# Altium project MainBoard.PrjPCB (part 2 of 2)

## Sheet Mainboard_Breakbeam_Interface.SchDoc
size A4
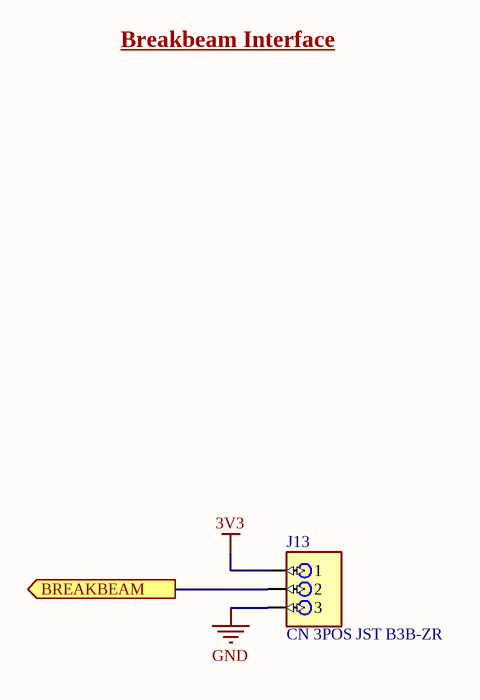
[diagram p6: Mainboard_Breakbeam_Interface.SchDoc]

### Parts
J13  CN 3POS JST B3B-ZR  [CN 3POS JST B3B-ZR]

### Ports
BREAKBEAM (out)

### Nets
3V3: J13.1
GND: J13.3
NetJ13_2: J13.2 ; port BREAKBEAM

### Notes on the sheet
- Breakbeam Interface

### Library data of the parts
J13 = CN 3POS JST B3B-ZR: Connector Header Through Hole 3 position 0.059 (1.50mm); MF: JST Sales; Price: $0.18; MP: B3B-ZR; Package: Bulk; Check_prices: https://www.snapeda.com/parts/B3B-ZR/JST%20Sales%20America%20Inc./view-part/496625/?ref=eda; SnapEDA_Link: https://www.snapeda.com/parts/B3B-ZR/JST%20Sales%20America%20Inc./view-part/496625/?ref=snap; Value: *; Availability: Active; ComponentLink1Description: Digikey Link; ComponentLink1URL: https://www.digikey.com/en/products/detail/jst-sales-america-inc/B3B-ZR(LF)(SN)/926565?utm_source=snapeda&utm_medium=aggregator&utm_campaign=buynow

## Sheet MainBoard_MCU_Power.SchDoc
size B
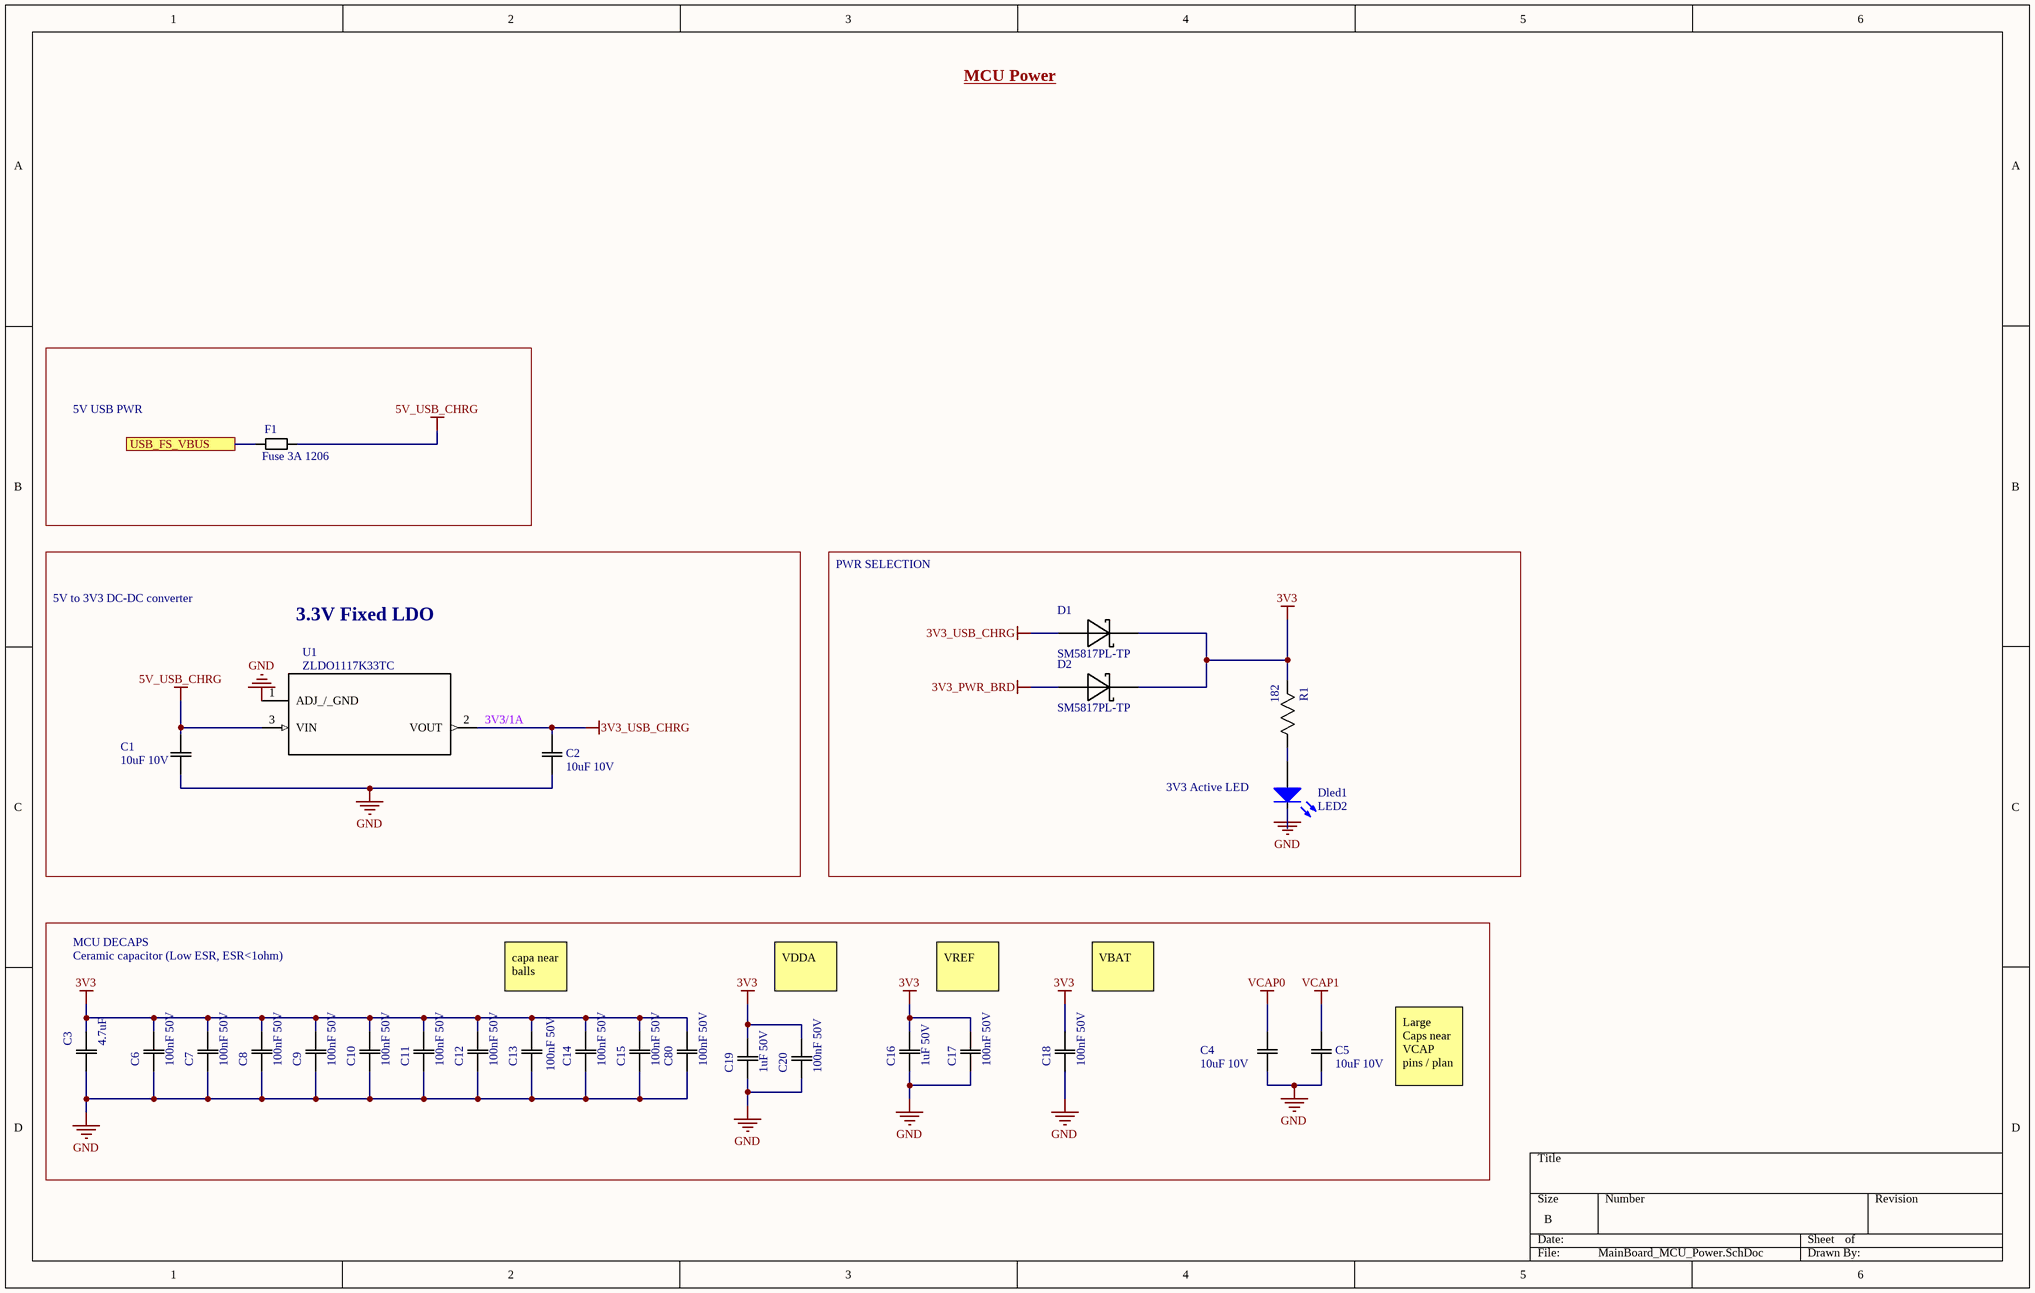
[diagram p7: MainBoard_MCU_Power.SchDoc]

### Parts
C1  10uF 10V  [0805]
C2  10uF 10V  [0805]
C3  4.7uF  [0805]
C4  10uF 10V  [0805]
C5  10uF 10V  [0805]
C6  100nF 50V  [0805]
C7  100nF 50V  [0805]
C8  100nF 50V  [0805]
C9  100nF 50V  [0805]
C10  100nF 50V  [0805]
C11  100nF 50V  [0805]
C12  100nF 50V  [0805]
C13  100nF 50V  [0805]
C14  100nF 50V  [0805]
C15  100nF 50V  [0805]
C16  1uF 50V  [0805]
C17  100nF 50V  [0805]
C18  100nF 50V  [0805]
C19  1uF 50V  [0805]
C20  100nF 50V  [0805]
C80  100nF 50V  [0805]
D1  SM5817PL-TP  [SOD-123]
D2  SM5817PL-TP  [SOD-123]
Dled1  LED2  [3.2X1.6X1.1]
F1  Fuse 3A 1206  [1206]
R1  182  [0805]
U1  ZLDO1117K33TC  [DPAK (TO-252)]

### Blocks framed on the sheet
5V USB PWR: F1
3.3V Fixed LDO: C1 C2 U1

### Ports
USB_FS_VBUS

### Nets
3V3: C3.2(C2) C6.2(C2) C7.2(C2) C8.2(C2) C9.2(C2) C10.2(C2) C11.2(C2) C12.2(C2) C13.2(C2) C14.2(C2) C15.2(C2) C16.2(C2) C17.2(C2) C18.2(C2) C19.2(C2) C20.2(C2) C80.2(C2) D1.C(K) D2.C(K) R1.2(R2)
3V3_PWR_BRD: D2.A
3V3_USB_CHRG: C2.1(C1) D1.A U1.2(VOUT)
5V_USB_CHRG: C1.1(C1) F1.2 U1.3(VIN)
GND: C1.2(C2) C2.2(C2) C3.1(C1) C4.2(C2) C5.2(C2) C6.1(C1) C7.1(C1) C8.1(C1) C9.1(C1) C10.1(C1) C11.1(C1) C12.1(C1) C13.1(C1) C14.1(C1) C15.1(C1) C16.1(C1) C17.1(C1) C18.1(C1) C19.1(C1) C20.1(C1) C80.1(C1) Dled1.2(K) U1.1(ADJ_/_GND)
VCAP0: C4.1(C1)
VCAP1: C5.1(C1)
NetDled1_1: Dled1.1(A) R1.1(R1)
NetF1_1: F1.1 ; port USB_FS_VBUS

### Notes on the sheet
- MCU Power
- PWR SELECTION
- 5V to 3V3 DC-DC converter
- 3V3/1A
- (near Dled1) 3V3 Active LED
- MCU DECAPS
- Ceramic capacitor (Low ESR, ESR<1ohm)
- capa near balls
- VDDA
- VREF
- VBAT
- Large Caps near VCAP pins / plan

### Library data of the parts
C1 C2 C4 C5 = CAP 10uF 10V: CAP CER 10UF 10V X5R 0805; Tolerance: 10%; Package: 0805; Value: 10uF; Rating: 10V
C3 = CAP 4.7uF 35V: CAP CER 4.7UF 35V X7R 0603/0805; Tolerance: 10%; Package: 0603/0805; Value: 4.7uF; Rating: 35V; Temperature Coefficient: X7R; Operating Temperature: -55°C ~ 125°C
C6-C15 C17 C18 C20 C80 = CAP 100nF 50V: as C27 on sheet Mainboard_Encoder_Interface; Package: 0805; Value: 100nF; Rating: 50V
C16 C19 = CAP 1uF 50V: CAP CER 1UF 50V X7R 0805; Tolerance: 10%; Package: 0805; Value: 1uF; Rating: 50V; Temperature Coefficient: X7R; Operating Temperature: -55°C ~ 125°C
D1 D2 = DIODE SCHOTTKY 20V 1A: Diode Schottky 20V 1A Surface Mount SOD-123FL; MF: Micro Commercial Co; ComponentLink1Description: digikey; ComponentLink1URL: https://www.digikey.ca/product-detail/en/on-semiconductor/MBR0540T1G/MBR0540T1GOSCT-ND/917967; Digikey: SM5817PL-TPMSCT-ND; Digikey Link: https://www.digikey.ca/product-detail/en/micro-commercial-co/SM5817PL-TP/SM5817PL-TPMSCT-ND/1793410; MP: SM5817PL-TP; Voltage Rating: 20V; Package: SOD-123; Current Rating: 1A
Dled1 = LED GREEN SMD: Typical RED, GREEN, YELLOW, AMBER GaAs LED; Voltage - Forward (Vf) (Typ): 2V; Lens Transparency: Clear; Current - Test: 20mA; Package: 1206; Color: Green
F1 = FUSE 3A 63V SLOW: FUSE 3A 63V AC/DC SLOW 1206; Response Time: Slow Blow; Current Rating (Amps): 3A; Operating Temperature: -55°C ~ 90°C; Voltage Rating - AC: 63V; Voltage Rating - DC: 63V
R1 = RES 182.0 1/8W: RES SMD 182 OHM 1% 1/8W 0805; Power (Watts): 0.125W; Package: 0805; Value: 182; Tolerance: 1%
U1 = ZLDO1117K33TC: Linear Voltage Regulator IC Positive Fixed 1 Output  1A TO-252-3; MF: Diodes Incorporated; Package: TO-252-3; MP: ZLDO1117K33TC; Digikey: ZLDO1117K33DIDKR-ND; Digikey Link: https://www.digikey.ca/product-detail/en/diodes-incorporated/ZLDO1117K33TC/ZLDO1117K33DIDKR-ND/2095639; Supplier 1: Digi-Key; Supplier Part Number 1: ZLDO1117K33DICT-ND

## Sheet Mainboard_Debug_Interface.SchDoc
size A4
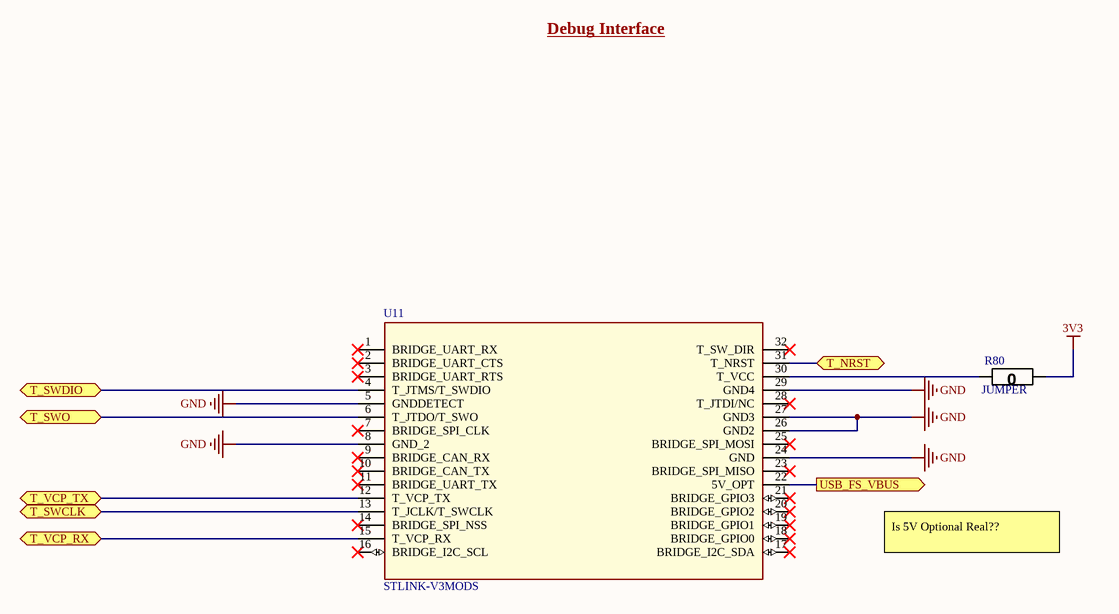
[diagram p8: Mainboard_Debug_Interface.SchDoc]

### Parts
R80  JUMPER  [0805]
U11  STLINK-V3MODS  [STLINK-V3MODS]

### Ports
T_NRST (bidir), T_SWCLK (bidir), T_SWDIO (bidir), T_SWO (bidir), T_VCP_RX (bidir), T_VCP_TX (bidir), USB_FS_VBUS (out)

### Nets
3V3: R80.1(R1)
GND: U11.5(GNDDETECT) U11.8(GND_2) U11.24(GND) U11.26(GND2) U11.27(GND3) U11.29(GND4)
NetC70_2: U11.31(T_NRST) ; port T_NRST
NetF1_1: U11.22(5V_OPT) ; port USB_FS_VBUS
NetR80_2: R80.2(R2) U11.30(T_VCC)
NetU11_4: U11.4(T_JTMS/T_SWDIO) ; port T_SWDIO
NetU11_6: U11.6(T_JTDO/T_SWO) ; port T_SWO
NetU11_12: U11.12(T_VCP_TX) ; port T_VCP_TX
NetU11_13: U11.13(T_JCLK/T_SWCLK) ; port T_SWCLK
NetU11_15: U11.15(T_VCP_RX) ; port T_VCP_RX

Not connected (* = marked no-connect by the designer): U11 1(BRIDGE_UART_RX)* 2(BRIDGE_UART_CTS)* 3(BRIDGE_UART_RTS)* 7(BRIDGE_SPI_CLK)* 9(BRIDGE_CAN_RX)* 10(BRIDGE_CAN_TX)* 11(BRIDGE_UART_TX)* 14(BRIDGE_SPI_NSS)* 16(BRIDGE_I2C_SCL)* 17(BRIDGE_I2C_SDA)* 18(BRIDGE_GPIO0)* 19(BRIDGE_GPIO1)* 20(BRIDGE_GPIO2)* 21(BRIDGE_GPIO3)* 23(BRIDGE_SPI_MISO)* 25(BRIDGE_SPI_MOSI)* 28(T_JTDI/NC)* 32(T_SW_DIR)*

### Notes on the sheet
- Debug Interface
- Is 5V Optional Real??

### Library data of the parts
R80 = RES 0 JUMPER: RES SMD 0 OHM JUMPER GENERIC 0805; Value: 0; Package: 0805
U11 = STLINK-V3MODS: STM32 - Debugger, Programmer (In-Circuit/In-System); MF: STMicroelectronics; MP: STLINK-V3MODS; Price: $12.15; ComponentLink1Description: Digikey; ComponentLink1URL: https://www.digikey.ca/en/products/detail/stmicroelectronics/stlink-v3mods/11610874; ComponentLink2Description: SnapEDA; ComponentLink2URL: https://www.snapeda.com/parts/STLINK-V3MODS/STMicroelectronics/view-part/; ComponentLink3Description: Datasheet; ComponentLink3URL: https://www.st.com/resource/en/data_brief/stlink-v3mods.pdf; Digikey PN: 497-STLINK-V3MODS-ND

## Sheet Mainboard_MCU_Breakout.SchDoc
size A4
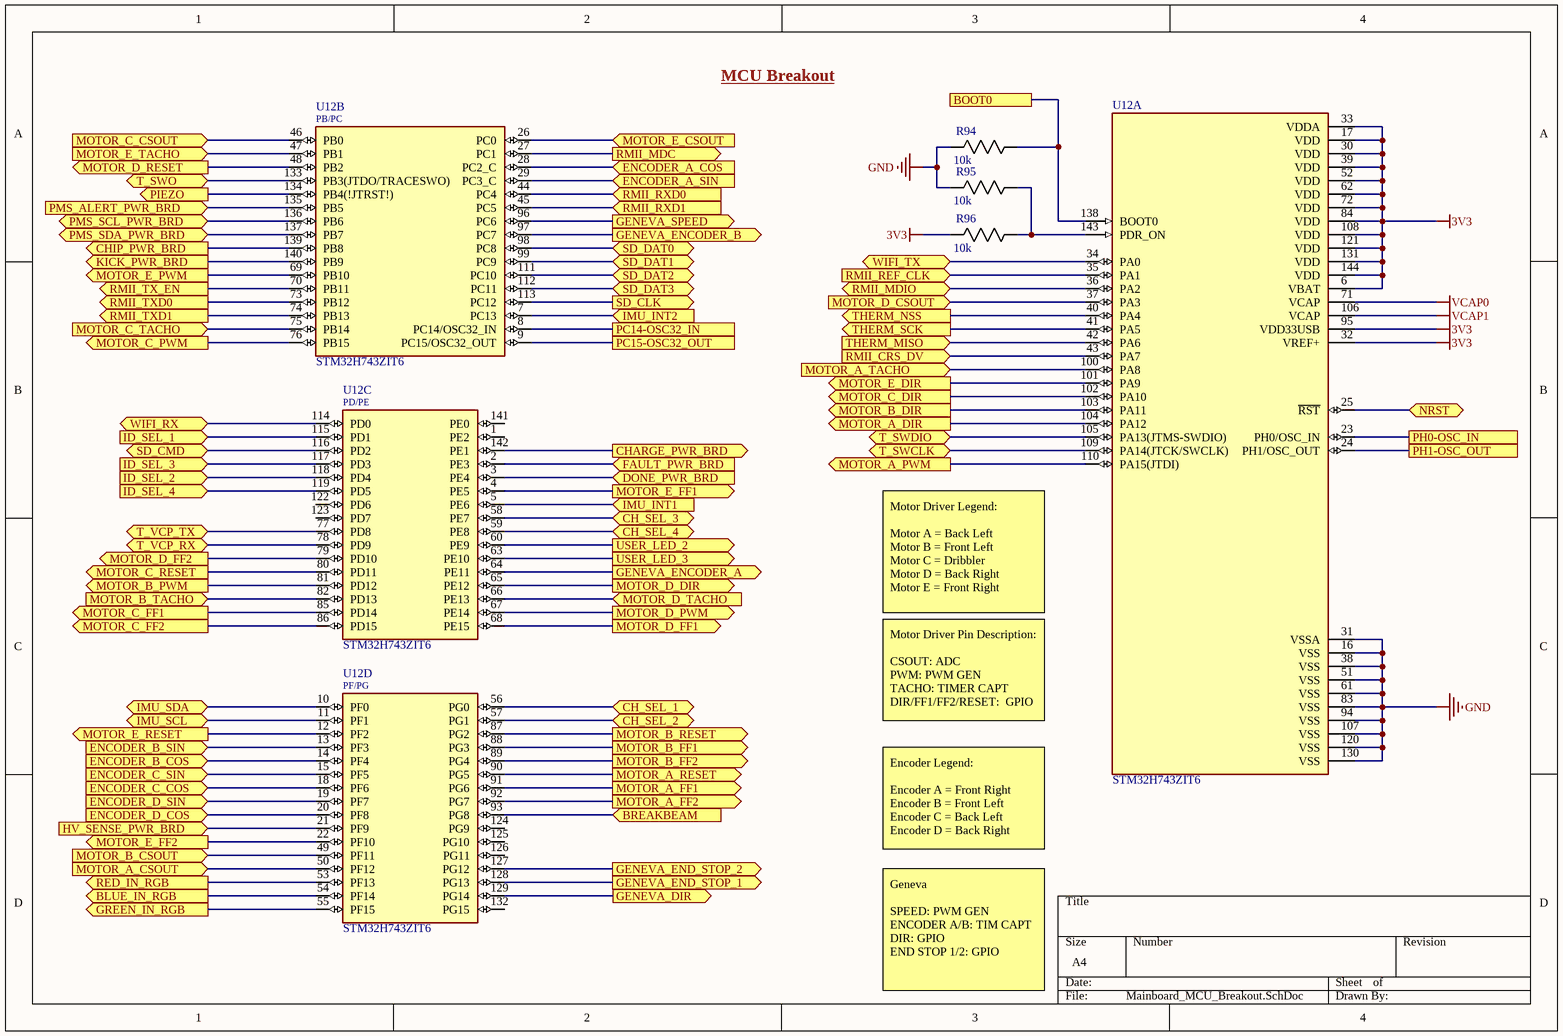
[diagram p9: Mainboard_MCU_Breakout.SchDoc]

### Parts
R94  10k  [0805]
R95  10k  [0805]
R96  10k  [0805]
U12  STM32H743ZIT6  [QFP50P2200X2200X160-144N]  (parts A,B,C,D of 4)

### Ports
BLUE_IN_RGB (out), BOOT0, BREAKBEAM (in), CH_SEL_1 (bidir), CH_SEL_2 (bidir), CH_SEL_3 (bidir), CH_SEL_4 (bidir), CHARGE_PWR_BRD (out), CHIP_PWR_BRD (out), DONE_PWR_BRD (in), ENCODER_A_COS (in), ENCODER_A_SIN (in), ENCODER_B_COS (in), ENCODER_B_SIN (in), ENCODER_C_COS (in), ENCODER_C_SIN (in), ENCODER_D_COS (in), ENCODER_D_SIN (in), FAULT_PWR_BRD (in), GENEVA_DIR (out), GENEVA_ENCODER_A (out), GENEVA_ENCODER_B (out), GENEVA_END_STOP_1 (out), GENEVA_END_STOP_2 (out), GENEVA_SPEED (out), GREEN_IN_RGB (out), HV_SENSE_PWR_BRD (in), ID_SEL_1 (in), ID_SEL_2 (in), ID_SEL_3 (in), ID_SEL_4 (in), IMU_INT1 (in), IMU_INT2 (in), IMU_SCL (bidir), IMU_SDA (bidir), KICK_PWR_BRD (out), MOTOR_A_CSOUT (in), MOTOR_A_DIR (out), MOTOR_A_FF1 (out), MOTOR_A_FF2 (out), MOTOR_A_PWM (out), MOTOR_A_RESET (out), MOTOR_A_TACHO (in), MOTOR_B_CSOUT (in), MOTOR_B_DIR (out), MOTOR_B_FF1 (out), MOTOR_B_FF2 (out), MOTOR_B_PWM (out), MOTOR_B_RESET (out), MOTOR_B_TACHO (in), MOTOR_C_CSOUT (in), MOTOR_C_DIR (out), MOTOR_C_FF1 (out), MOTOR_C_FF2 (out), MOTOR_C_PWM (out), MOTOR_C_RESET (out), MOTOR_C_TACHO (in), MOTOR_D_CSOUT (in), MOTOR_D_DIR (out), MOTOR_D_FF1 (out), MOTOR_D_FF2 (out), MOTOR_D_PWM (out), MOTOR_D_RESET (out), MOTOR_D_TACHO (in), MOTOR_E_CSOUT (in), MOTOR_E_DIR (out), MOTOR_E_FF1 (out), MOTOR_E_FF2 (out), MOTOR_E_PWM (out), MOTOR_E_RESET (out), MOTOR_E_TACHO (in), NRST (bidir), PC14-OSC32_IN, PC15-OSC32_OUT, PH0-OSC_IN, PH1-OSC_OUT, PIEZO (out), PMS_ALERT_PWR_BRD (in), PMS_SCL_PWR_BRD (bidir), PMS_SDA_PWR_BRD (bidir), RED_IN_RGB (out), RMII_CRS_DV (in), RMII_MDC (out), RMII_MDIO (bidir), RMII_REF_CLK (in), RMII_RXD0 (in), RMII_RXD1 (in), RMII_TX_EN (out), RMII_TXD0 (out), RMII_TXD1 (out), SD_CLK (out), SD_CMD (bidir), SD_DAT0 (bidir), SD_DAT1 (bidir), SD_DAT2 (bidir), SD_DAT3 (bidir), T_SWCLK (bidir), T_SWDIO (bidir), T_SWO (bidir), T_VCP_RX (bidir), T_VCP_TX (bidir), THERM_MISO (in), THERM_NSS (out), THERM_SCK (out), USER_LED_2 (out), USER_LED_3 (out), WIFI_RX (bidir), WIFI_TX (bidir)

### Nets
3V3: R96.2(R2) U12.6(VBAT) U12.17(VDD) U12.30(VDD) U12.32(VREF+) U12.33(VDDA) U12.39(VDD) U12.52(VDD) U12.62(VDD) U12.72(VDD) U12.84(VDD) U12.95(VDD33USB) U12.108(VDD) U12.121(VDD) U12.131(VDD) U12.144(VDD)
GND: R94.2(R2) R95.2(R2) U12.16(VSS) U12.31(VSSA) U12.38(VSS) U12.51(VSS) U12.61(VSS) U12.83(VSS) U12.94(VSS) U12.107(VSS) U12.120(VSS) U12.130(VSS)
VCAP0: U12.71(VCAP)
VCAP1: U12.106(VCAP)
COS_A: U12.28(PC2_C) ; port ENCODER_A_COS
COS_B: U12.14(PF4) ; port ENCODER_B_COS
COS_C: U12.18(PF6) ; port ENCODER_C_COS
COS_D: U12.20(PF8) ; port ENCODER_D_COS
GEN_DIR: U12.129(PG14) ; port GENEVA_DIR
GEN_ES1: U12.128(PG13) ; port GENEVA_END_STOP_1
GEN_ES2: U12.127(PG12) ; port GENEVA_END_STOP_2
GEN_SPD: U12.96(PC6) ; port GENEVA_SPEED
GENENC_A: U12.64(PE11) ; port GENEVA_ENCODER_A
GENENC_B: U12.97(PC7) ; port GENEVA_ENCODER_B
PC14-OSC32_IN: U12.8(PC14/OSC32_IN) ; port PC14-OSC32_IN
PC15-OSC32_OUT: U12.9(PC15/OSC32_OUT) ; port PC15-OSC32_OUT
PH0-OSC_IN: U12.23(PH0/OSC_IN) ; port PH0-OSC_IN
PH1-OSC_OUT: U12.24(PH1/OSC_OUT) ; port PH1-OSC_OUT
RMII_MDIO: U12.36(PA2) ; port RMII_MDIO
RMII_REF_CLK: U12.35(PA1) ; port RMII_REF_CLK
RMII_TX_EN: U12.70(PB11) ; port RMII_TX_EN
RMII_TXD0: U12.73(PB12) ; port RMII_TXD0
RMII_TXD1: U12.74(PB13) ; port RMII_TXD1
SIN_A: U12.29(PC3_C) ; port ENCODER_A_SIN
SIN_B: U12.13(PF3) ; port ENCODER_B_SIN
SIN_C: U12.15(PF5) ; port ENCODER_C_SIN
SIN_D: U12.19(PF7) ; port ENCODER_D_SIN
NetC70_2: U12.25(~{RST}) ; port NRST
NetD4_1: U12.134(PB4(!JTRST!)) ; port PIEZO
NetJ6_21: U12.142(PE1) ; port CHARGE_PWR_BRD
NetJ6_22: U12.140(PB9) ; port KICK_PWR_BRD
NetJ6_23: U12.2(PE3) ; port FAULT_PWR_BRD
NetJ6_24: U12.139(PB8) ; port CHIP_PWR_BRD
NetJ6_25: U12.3(PE4) ; port DONE_PWR_BRD
NetJ6_26: U12.135(PB5) ; port PMS_ALERT_PWR_BRD
NetJ6_27: U12.137(PB7) ; port PMS_SDA_PWR_BRD
NetJ6_29: U12.136(PB6) ; port PMS_SCL_PWR_BRD
NetJ6_34: U12.21(PF9) ; port HV_SENSE_PWR_BRD
NetJ7_A12: U12.50(PF12) ; port MOTOR_A_CSOUT
NetJ7_A14: U12.110(PA15(JTDI)) ; port MOTOR_A_PWM
NetJ7_A15: U12.104(PA12) ; port MOTOR_A_DIR
NetJ7_A16: U12.100(PA8) ; port MOTOR_A_TACHO
NetJ7_B16: U12.91(PG6) ; port MOTOR_A_FF1
NetJ7_B17: U12.92(PG7) ; port MOTOR_A_FF2
NetJ7_B18: U12.90(PG5) ; port MOTOR_A_RESET
NetJ8_A12: U12.46(PB0) ; port MOTOR_C_CSOUT
NetJ8_A14: U12.76(PB15) ; port MOTOR_C_PWM
NetJ8_A15: U12.102(PA10) ; port MOTOR_C_DIR
NetJ8_A16: U12.75(PB14) ; port MOTOR_C_TACHO
NetJ8_B16: U12.85(PD14) ; port MOTOR_C_FF1
NetJ8_B17: U12.86(PD15) ; port MOTOR_C_FF2
NetJ8_B18: U12.80(PD11) ; port MOTOR_C_RESET
NetJ9_A12: U12.26(PC0) ; port MOTOR_E_CSOUT
NetJ9_A14: U12.69(PB10) ; port MOTOR_E_PWM
NetJ9_A15: U12.101(PA9) ; port MOTOR_E_DIR
NetJ9_A16: U12.47(PB1) ; port MOTOR_E_TACHO
NetJ9_B16: U12.4(PE5) ; port MOTOR_E_FF1
NetJ9_B17: U12.22(PF10) ; port MOTOR_E_FF2
NetJ9_B18: U12.12(PF2) ; port MOTOR_E_RESET
NetJ10_A12: U12.49(PF11) ; port MOTOR_B_CSOUT
NetJ10_A14: U12.81(PD12) ; port MOTOR_B_PWM
NetJ10_A15: U12.103(PA11) ; port MOTOR_B_DIR
NetJ10_A16: U12.82(PD13) ; port MOTOR_B_TACHO
NetJ10_B16: U12.88(PG3) ; port MOTOR_B_FF1
NetJ10_B17: U12.89(PG4) ; port MOTOR_B_FF2
NetJ10_B18: U12.87(PG2) ; port MOTOR_B_RESET
NetJ11_A12: U12.37(PA3) ; port MOTOR_D_CSOUT
NetJ11_A14: U12.67(PE14) ; port MOTOR_D_PWM
NetJ11_A15: U12.65(PE12) ; port MOTOR_D_DIR
NetJ11_A16: U12.66(PE13) ; port MOTOR_D_TACHO
NetJ11_B16: U12.68(PE15) ; port MOTOR_D_FF1
NetJ11_B17: U12.79(PD10) ; port MOTOR_D_FF2
NetJ11_B18: U12.48(PB2) ; port MOTOR_D_RESET
NetJ12_2: U12.114(PD0) ; port WIFI_RX
NetJ12_3: U12.34(PA0) ; port WIFI_TX
NetJ13_2: U12.93(PG8) ; port BREAKBEAM
NetJ14_1: U12.111(PC10) ; port SD_DAT2
NetJ14_2: U12.112(PC11) ; port SD_DAT3
NetJ14_3: U12.116(PD2) ; port SD_CMD
NetJ14_5: U12.113(PC12) ; port SD_CLK
NetJ14_7: U12.98(PC8) ; port SD_DAT0
NetJ14_8: U12.99(PC9) ; port SD_DAT1
NetPboot1_1: R94.1(R1) U12.138(BOOT0) ; port BOOT0
NetR63_2: U12.44(PC4) ; port RMII_RXD0
NetR64_2: U12.45(PC5) ; port RMII_RXD1
NetR66_2: U12.43(PA7) ; port RMII_CRS_DV
NetR85_2: U12.60(PE9) ; port USER_LED_2
NetR88_1: U12.53(PF13) ; port RED_IN_RGB
NetR89_1: U12.54(PF14) ; port BLUE_IN_RGB
NetR90_1: U12.55(PF15) ; port GREEN_IN_RGB
NetR92_2: U12.63(PE10) ; port USER_LED_3
NetR95_1: R95.1(R1) R96.1(R1) U12.143(PDR_ON)
NetR98_1: U12.41(PA5) ; port THERM_SCK
NetR99_1: U12.42(PA6) ; port THERM_MISO
NetR100_1: U12.40(PA4) ; port THERM_NSS
NetS2_1A: U12.56(PG0) ; port CH_SEL_1
NetS2_2A: U12.57(PG1) ; port CH_SEL_2
NetS2_3A: U12.58(PE7) ; port CH_SEL_3
NetS2_4A: U12.59(PE8) ; port CH_SEL_4
NetS3_1A: U12.117(PD3) ; port ID_SEL_3
NetS3_2A: U12.115(PD1) ; port ID_SEL_1
NetS3_3A: U12.118(PD4) ; port ID_SEL_2
NetS3_4A: U12.119(PD5) ; port ID_SEL_4
NetU9_13: U12.27(PC1) ; port RMII_MDC
NetU10_4: U12.5(PE6) ; port IMU_INT1
NetU10_9: U12.7(PC13) ; port IMU_INT2
NetU10_13: U12.11(PF1) ; port IMU_SCL
NetU10_14: U12.10(PF0) ; port IMU_SDA
NetU11_4: U12.105(PA13(JTMS-SWDIO)) ; port T_SWDIO
NetU11_6: U12.133(PB3(JTDO/TRACESWO)) ; port T_SWO
NetU11_12: U12.77(PD8) ; port T_VCP_TX
NetU11_13: U12.109(PA14(JTCK/SWCLK)) ; port T_SWCLK
NetU11_15: U12.78(PD9) ; port T_VCP_RX

Not connected (* = marked no-connect by the designer): U12 1(PE2) 122(PD6) 123(PD7) 124(PG9) 125(PG10) 126(PG11) 132(PG15) 141(PE0)

### Notes on the sheet
- MCU Breakout
- Motor Driver Legend:
  Motor A = Back Left
  Motor B = Front Left
  Motor C = Dribbler
  Motor D = Back Right
  Motor E = Front Right
- Motor Driver Pin Description:
  CSOUT: ADC
  PWM: PWM GEN
  TACHO: TIMER CAPT
  DIR/FF1/FF2/RESET:  GPIO
- Encoder Legend:
  Encoder A = Front Right
  Encoder B = Front Left
  Encoder C = Back Left
  Encoder D = Back Right
- Geneva
  SPEED: PWM GEN
  ENCODER A/B: TIM CAPT
  DIR: GPIO
  END STOP 1/2: GPIO
- (in symbol STM32H743ZIT6, part B) PB/PC
- (in symbol STM32H743ZIT6, part C) PD/PE
- (in symbol STM32H743ZIT6, part D) PF/PG

### Library data of the parts
R94-R96 = RES 10k 1/8W - 1%: RES SMD 10K OHM 1% 1/8W 0805; Power (Watts): 0.125W; Package: 0805; Value: 10k; Tolerance: 1%
U12 = STM32H743ZIT6: ARM® Cortex®-M7 STM32H7 Microcontroller IC 32-Bit 480MHz 2MB (2M x 8) FLASH 144-LQFP (20x20); MF: STMicroelectronics; Package: LQFP-144 STMicroelectronics; MP: STM32H743ZIT6; ComponentLink1Description: SnapEDA; ComponentLink1URL: https://www.snapeda.com/parts/STM32H743ZIT6/STMicroelectronics/view-part/1041111/?ref=snap; ComponentLink2Description: DigiKey; ComponentLink2URL: https://www.digikey.ca/en/products/detail/stmicroelectronics/STM32H743ZIT6/7809238; ComponentLink3Description: Datasheet; ComponentLink3URL: https://www.st.com/resource/en/datasheet/stm32h743bi.pdf; DigiKey PN: 497-17721-ND

## Sheet Mainboard_MCU_Func.SchDoc
size A4
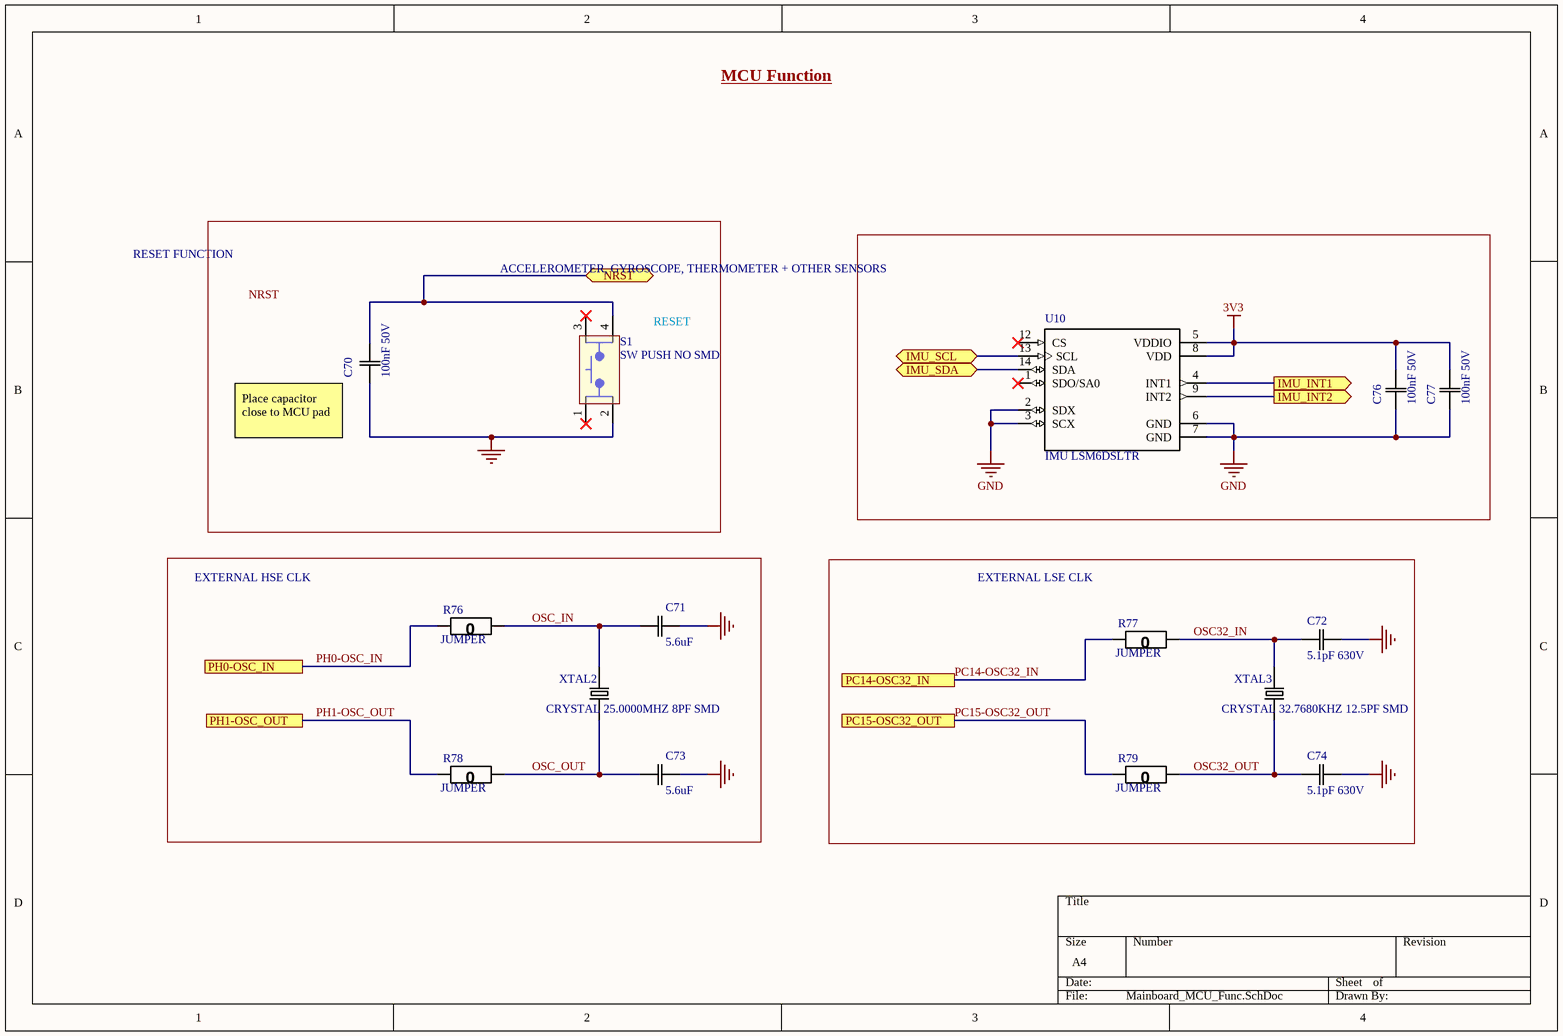
[diagram p10: Mainboard_MCU_Func.SchDoc]

### Parts
C70  100nF 50V  [0805]
C71  5.6uF  [0805]
C72  5.1pF 630V  [0805]
C73  5.6uF  [0805]
C74  5.1pF 630V  [0805]
C76  100nF 50V  [0805]
C77  100nF 50V  [0805]
R76  JUMPER  [0805]
R77  JUMPER  [0805]
R78  JUMPER  [0805]
R79  JUMPER  [0805]
S1  SW PUSH NO SMD  [TL3305]
U10  IMU LSM6DSLTR  [LGA-14]
XTAL2  CRYSTAL 25.0000MHZ 8PF SMD  [SMD-2]
XTAL3  CRYSTAL 32.7680KHZ 12.5PF SMD  [SMD-2]

### Blocks framed on the sheet
ACCELEROMETER, GYROSCOPE, THERMOMETER + OTHER SENSORS: C76 C77 U10
EXTERNAL HSE CLK: C71 C73 R76 R78 XTAL2
EXTERNAL LSE CLK: C72 C74 R77 R79 XTAL3

### Ports
IMU_INT1 (out), IMU_INT2 (out), IMU_SCL (bidir), IMU_SDA (bidir), NRST (bidir), PC14-OSC32_IN, PC15-OSC32_OUT, PH0-OSC_IN, PH1-OSC_OUT

### Nets
3V3: C76.2(C2) C77.2(C2) U10.5(VDDIO) U10.8(VDD)
GND: C70.1(C1) C71.2(C2) C72.2(C2) C73.2(C2) C74.2(C2) C76.1(C1) C77.1(C1) S1.2 U10.2(SDX) U10.3(SCX) U10.6(GND) U10.7(GND)
OSC32_IN: C72.1(C1) R77.1(R1) XTAL3.2
OSC32_OUT: C74.1(C1) R79.1(R1) XTAL3.1
OSC_IN: C71.1(C1) R76.1(R1) XTAL2.2
OSC_OUT: C73.1(C1) R78.1(R1) XTAL2.1
PC14-OSC32_IN: R77.2(R2) ; port PC14-OSC32_IN
PC15-OSC32_OUT: R79.2(R2) ; port PC15-OSC32_OUT
PH0-OSC_IN: R76.2(R2) ; port PH0-OSC_IN
PH1-OSC_OUT: R78.2(R2) ; port PH1-OSC_OUT
NetC70_2: C70.2(C2) S1.4 ; port NRST
NetU10_4: U10.4(INT1) ; port IMU_INT1
NetU10_9: U10.9(INT2) ; port IMU_INT2
NetU10_13: U10.13(SCL) ; port IMU_SCL
NetU10_14: U10.14(SDA) ; port IMU_SDA

Not connected (* = marked no-connect by the designer): S1 1* 3*; U10 1(SDO/SA0)* 12(CS)*

### Notes on the sheet
- MCU Function
- RESET FUNCTION
- (near S1) RESET
- (near C70) Place capacitor close to MCU pad
- Labels drawn without touching a wire or pin: NRST

### Library data of the parts
C70 C76 C77 = CAP 100nF 50V: CAP CER 0.1UF 50V X7R 0805; Tolerance: 10%; Package: 0805; Value: 100nF; Rating: 50V
C71 C73 = CAP 5.6uF 6.3V: CAP CER 5.6UF 6.3V X5R 0805; Tolerance: 10%; Package: 0805; Value: 5.6uF; Rating: 6.3V; Temperature Coefficient: X5R; Operating Temperature: -55°C ~ 85°C
C72 C74 = CAP 5.1pF 630V: CAP CER 5.1PF 630V C0G/NP0 0805; Tolerance: 10%; Rating: 50V; Package: 0805; Value: 5.1pF; Temperature Coefficient: C0G/NP0; Operating Temperature: -55°C ~ 125°C
R76-R79 = RES 0 JUMPER: RES SMD 0 OHM JUMPER GENERIC 0805; Value: 0; Package: 0805
S1 = SW PUSH NO SMD: Tactile Switch SPST-NO Top Actuated Surface Mount 12V 50mA; MF: E-Switch; MP: TL3305BF260QG; Switch Function: Off-Mom; Actuator Height: 5mm; Digikey: EG5354DKR-ND; ComponentLink1Description: Digikey; ComponentLink1URL: https://www.digikey.ca/en/products/detail/e-switch/TL3305BF260QG/5816185; ComponentLink2Description: Datasheet; ComponentLink2URL: https://sten-eswitch-13110800-production.s3.amazonaws.com/system/asset/product_line/data_sheet/213/TL3305.pdf; Circuit: SPST-NO; Mounting Type: SMD
U10 = IMU LSM6DSLTR: IMU ACCEL/GYRO I2C/SPI 14LGA; MF: STMicroelectronics; SnapEDA_Link: https://www.snapeda.com/parts/LSM6DSLTR/STMicroelectronics/view-part/550517/?ref=snap; MP: LSM6DSLTR; Package: LGA-14 STMicroelectronics; Digikey: https://www.digikey.ca/product-detail/en/stmicroelectronics/LSM6DSLTR/497-16705-1-ND/6192805; Supplier 1: Digi-Key; Supplier Part Number 1: 497-16705-1-ND
XTAL2 = XTAL 25MHZ 8PF SMD: 25MHz ±50ppm Crystal 8pF 70 Ohms 2-SMD, No Lead; MP: NX5032GA-25.000000MHZ-LN-CD-1; MF: NDK America, Inc.; ESR: 70 Ohms; Package: 2-SMD, No Lead; Price: 0.95 CAD; Frequency: 25MHz; Digikey: 644-1041-1-ND; Digikey Link: https://www.digikey.ca/product-detail/en/ndk-america-inc/NX5032GA-25.000000MHZ-LN-CD-1/644-1041-1-ND/1128913; Load Capacitance: 8pF; Supplier 1: Digi-Key; Supplier Part Number 1: 644-1041-1-ND
XTAL3 = XTAL 32.7680KHZ 12.5PF SMD: 32.768kHz ±20ppm Crystal 12.5pF 70 kOhms 2-SMD, No Lead; MP: NX3215SA-32.768K-STD-MUA-8; MF: NDK America, Inc.; Package: 2-SMD, No Lead; Price: 1.04000 CAD; Frequency: 32.768kHz; Digikey: 644-1156-1-ND; Digikey Link: https://www.digikey.ca/en/products/detail/ndk-america-inc/NX3215SA-32-768K-STD-MUA-8/2261469?s=N4IgTCBcDaIGwBYEFoCMqCsc3IHIBEQBdAXyA; Load Capacitance: 12.5pF; ESR: 70 kOhms; ComponentLink1Description: Digikey; ComponentLink1URL: https://www.digikey.ca/en/products/detail/ndk-america-inc/NX3215SA-32-768K-STD-MUA-8/2261469; ComponentLink2Description: Datasheet; ComponentLink2URL: https://media.digikey.com/datasheets/production/702868/1/NX3215SA-32-768K-STD-MUA-8.html; Supplier 1: Digi-Key; Supplier Part Number 1: 644-1156-1-ND

## Sheet Mainboard_ThermistorAmp.SchDoc
size A
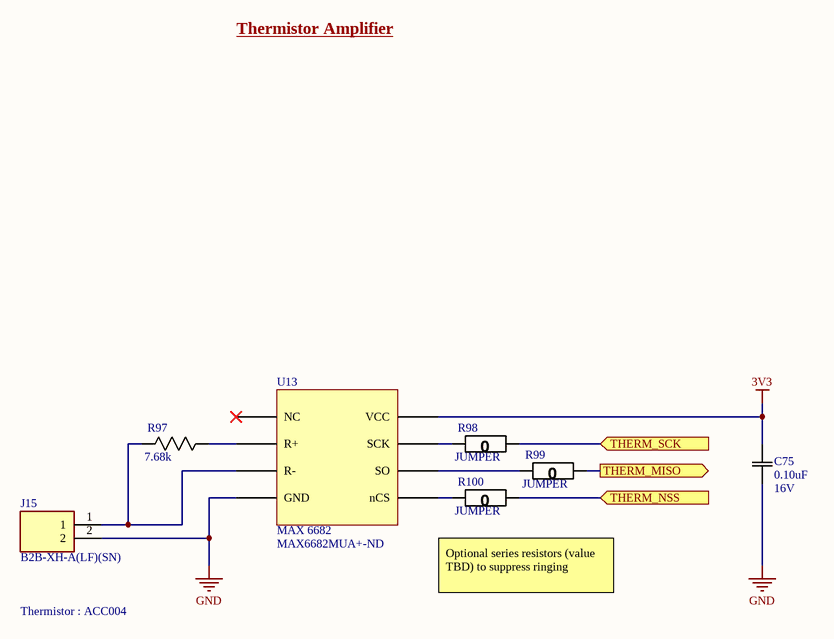
[diagram p11: Mainboard_ThermistorAmp.SchDoc]

### Parts
C75  Rating: 16V  [0805]  (hidden comment: 0.10uF)
J15  B2B-XH-A(LF)(SN)  [JST_B2B-XH-A(LF)(SN)]
R97  7.68k  [0805]
R98  JUMPER  [0805]
R99  JUMPER  [0805]
R100  JUMPER  [0805]
U13  MAX 6682  Supplier Part Number 1: MAX6682MUA+-ND  [8-MSOP]

### Ports
THERM_MISO (out), THERM_NSS (in), THERM_SCK (in)

### Nets
3V3: C75.1(C1) U13.8(VCC)
GND: C75.2(C2) J15.2 U13.4(GND)
NetJ15_1: J15.1 R97.2(R2) U13.3(R-)
NetR97_1: R97.1(R1) U13.2(R+)
NetR98_1: R98.1(R1) ; port THERM_SCK
NetR98_2: R98.2(R2) U13.7(SCK)
NetR99_1: R99.1(R1) ; port THERM_MISO
NetR99_2: R99.2(R2) U13.6(SO)
NetR100_1: R100.1(R1) ; port THERM_NSS
NetR100_2: R100.2(R2) U13.5(nCS)

Not connected (* = marked no-connect by the designer): U13 1(NC)*

### Notes on the sheet
- Thermistor Amplifier
- Optional series resistors (value TBD) to suppress ringing
- Thermistor : ACC004

### Library data of the parts
C75 = CAP 0.10uF 16V: CAP CER 0.10UF 16V X5R 0603/0805; Tolerance: 10%; Package: 0603/0805; Temperature Coefficient: X5R; Operating Temperature: -55°C ~ 85°C; Value: 0.10uF
J15 = B2B-XH-A(LF)(SN): Connector Header Through Hole 2 position 0.098 _2.50mm_ / JST XH; MP: B2B-XH-A_LF__SN_; MF: JST Sales; Price: None; Package: None; Value: *; Availability: Unavailable; SnapEDA_Link: https://www.snapeda.com/parts/B2B-XH-A%28LF%29%28SN%29/JST%20Sales%20America%20Inc./view-part/492310/?ref=snap
R97 = RES 7.68k 0.15W: RES SMD 7.68K OHM 0.1% 0.15W 0805; Power (Watts): 0.125W; Tolerance: 5%; Package: 0805; Value: 7.68k
R98-R100 = RES 0 JUMPER: as R76-R79 on sheet Mainboard_MCU_Func; Package: 0805
U13 = MAX 6682: MAX 6685 Thermistor - SPI converter, 8bit; Supplier 1: Digi-Key

## Sheet Mainboard_User_Interface.SchDoc
size A4
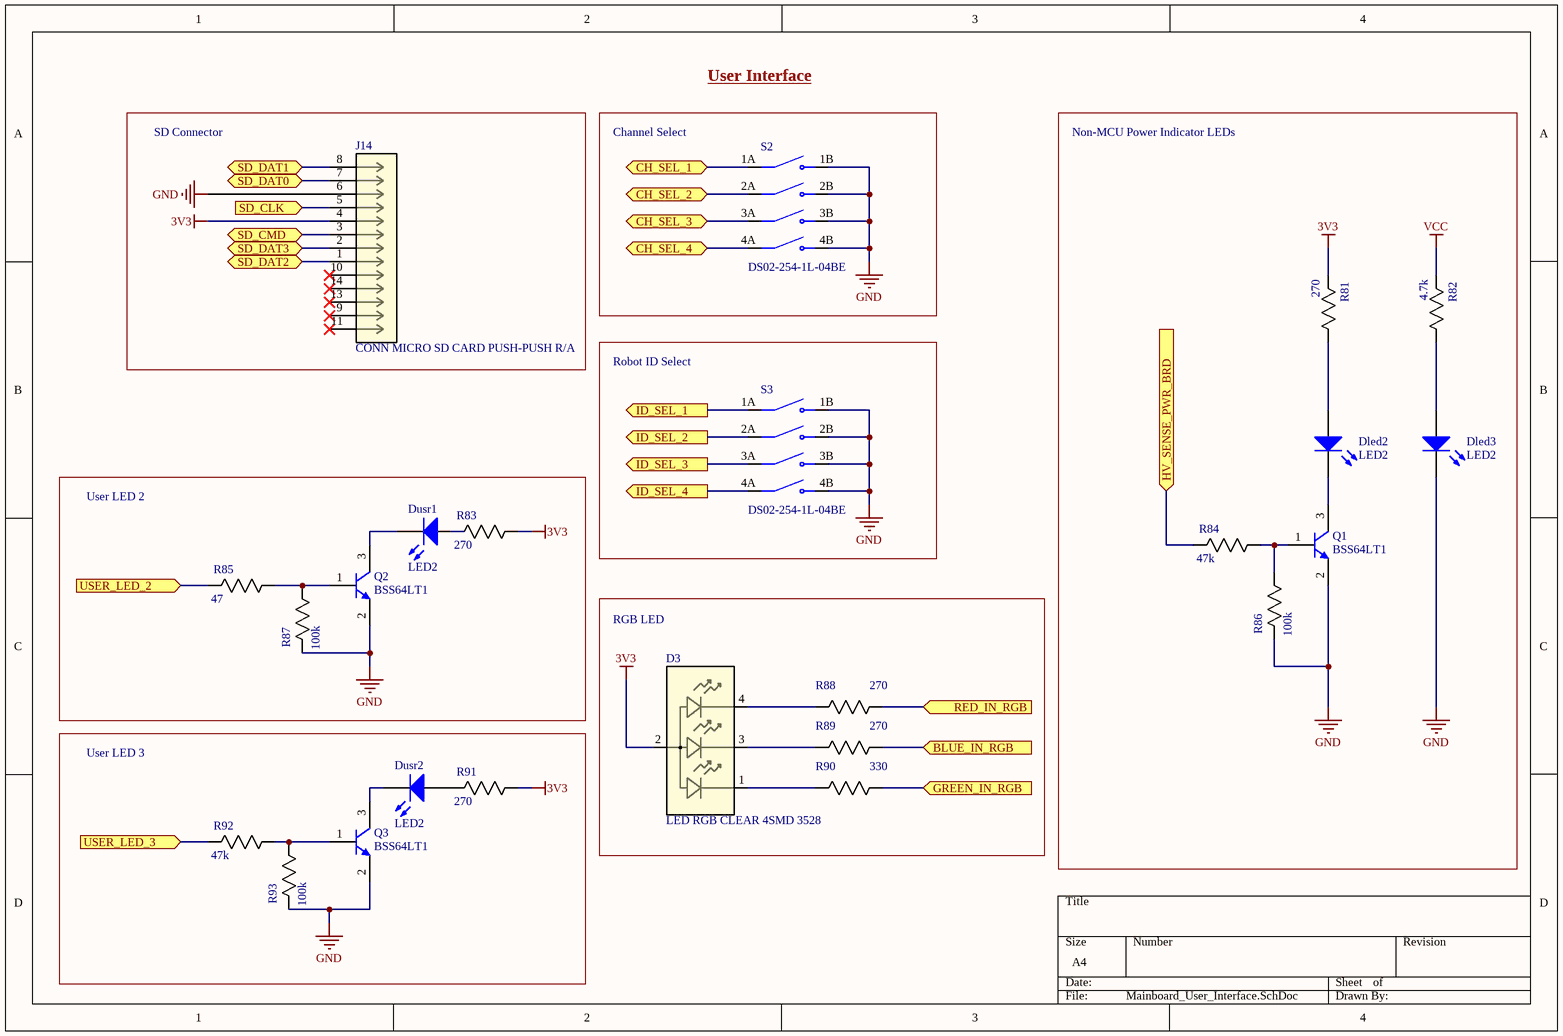
[diagram p12: Mainboard_User_Interface.SchDoc]

### Parts
D3  LED RGB CLEAR 4SMD 3528  [LED 4pin 3.5 x 2.8]
Dled2  LED2  [3.2X1.6X1.1]
Dled3  LED2  [3.2X1.6X1.1]
Dusr1  LED2  [3.2X1.6X1.1]
Dusr2  LED2  [3.2X1.6X1.1]
J14  CONN MICRO SD CARD PUSH-PUSH R/A  [SD Connector 5027740891]
Q1  BSS64LT1  [ONSC-SOT-23-3-318-08_V]
Q2  BSS64LT1  [ONSC-SOT-23-3-318-08_V]
Q3  BSS64LT1  [ONSC-SOT-23-3-318-08_V]
R81  270  [0805]
R82  4.7k  [0805]
R83  270  [0805]
R84  47k  [0805]
R85  47  [0805]
R86  100k  [0805]
R87  100k  [0805]
R88  270  [0805]
R89  270  [0805]
R90  330  [0805]
R91  270  [0805]
R92  47k  [0805]
R93  100k  [0805]
S2  DS02-254-1L-04BE  [SW_DS02-254-1L-04BE]
S3  DS02-254-1L-04BE  [SW_DS02-254-1L-04BE]

### Blocks framed on the sheet
SD Connector: J14
Channel Select: S2
Non-MCU Power Indicator LEDs: Dled2 Dled3 Q1 R81 R82 R84 R86
Robot ID Select: S3
User LED 2: Dusr1 Q2 R83 R85 R87
RGB LED: D3 R88-R90
User LED 3: Dusr2 Q3 R91-R93

### Ports
BLUE_IN_RGB (in), CH_SEL_1 (bidir), CH_SEL_2 (bidir), CH_SEL_3 (bidir), CH_SEL_4 (bidir), GREEN_IN_RGB (in), HV_SENSE_PWR_BRD (in), ID_SEL_1 (out), ID_SEL_2 (out), ID_SEL_3 (out), ID_SEL_4 (out), RED_IN_RGB (in), SD_CLK (in), SD_CMD (bidir), SD_DAT0 (bidir), SD_DAT1 (bidir), SD_DAT2 (bidir), SD_DAT3 (bidir), USER_LED_2 (in), USER_LED_3 (in)

### Nets
3V3: D3.2 J14.4 R81.2(R2) R83.1(R1) R91.1(R1)
GND: Dled3.2(K) J14.6 Q1.2(E) Q2.2(E) Q3.2(E) R86.2(R2) R87.2(R2) R93.2(R2) S2.1B(NO1) S2.2B(NO2) S2.3B(NO3) S2.4B(NO4) S3.1B(NO1) S3.2B(NO2) S3.3B(NO3) S3.4B(NO4)
VCC: R82.2(R2)
NetD3_1: D3.1 R90.2(R2)
NetD3_3: D3.3 R89.2(R2)
NetD3_4: D3.4 R88.2(R2)
NetDled2_1: Dled2.1(A) R81.1(R1)
NetDled2_2: Dled2.2(K) Q1.3(C)
NetDled3_1: Dled3.1(A) R82.1(R1)
NetDusr1_1: Dusr1.1(A) R83.2(R2)
NetDusr1_2: Dusr1.2(K) Q2.3(C)
NetDusr2_1: Dusr2.1(A) R91.2(R2)
NetDusr2_2: Dusr2.2(K) Q3.3(C)
NetJ6_34: R84.2(R2) ; port HV_SENSE_PWR_BRD
NetJ14_1: J14.1 ; port SD_DAT2
NetJ14_2: J14.2 ; port SD_DAT3
NetJ14_3: J14.3 ; port SD_CMD
NetJ14_5: J14.5 ; port SD_CLK
NetJ14_7: J14.7 ; port SD_DAT0
NetJ14_8: J14.8 ; port SD_DAT1
NetQ1_1: Q1.1(B) R84.1(R1) R86.1(R1)
NetQ2_1: Q2.1(B) R85.1(R1) R87.1(R1)
NetQ3_1: Q3.1(B) R92.1(R1) R93.1(R1)
NetR85_2: R85.2(R2) ; port USER_LED_2
NetR88_1: R88.1(R1) ; port RED_IN_RGB
NetR89_1: R89.1(R1) ; port BLUE_IN_RGB
NetR90_1: R90.1(R1) ; port GREEN_IN_RGB
NetR92_2: R92.2(R2) ; port USER_LED_3
NetS2_1A: S2.1A(COM1) ; port CH_SEL_1
NetS2_2A: S2.2A(COM2) ; port CH_SEL_2
NetS2_3A: S2.3A(COM3) ; port CH_SEL_3
NetS2_4A: S2.4A(COM4) ; port CH_SEL_4
NetS3_1A: S3.1A(COM1) ; port ID_SEL_1
NetS3_2A: S3.2A(COM2) ; port ID_SEL_2
NetS3_3A: S3.3A(COM3) ; port ID_SEL_3
NetS3_4A: S3.4A(COM4) ; port ID_SEL_4

Not connected (* = marked no-connect by the designer): J14 9* 10* 11* 13* 14*

### Notes on the sheet
- User Interface

### Library data of the parts
D3 = LED RGB CLEAR 4SMD 3528: LED RGB No Lead / AAA3528
Dled2 Dled3 Dusr1 = LED GREEN SMD: Typical RED, GREEN, YELLOW, AMBER GaAs LED; Voltage - Forward (Vf) (Typ): 2V; Lens Transparency: Clear; Current - Test: 20mA; Package: 1206; Color: Green
Dusr2 = LED RED SMD: Typical RED, GREEN, YELLOW, AMBER GaAs LED; Lens Color: Colorless; Voltage - Forward (Vf) (Typ): 1.7V; Current - Test: 20mA; Lens Transparency: Clear; Package: 1206; Color: Red
J14 = CONN MICRO SD CARD PUSH-PUSH R/A: 10 (8 + 2) Position Card Connector Secure Digital - microSD™ Surface Mount, Right Angle Gold; MF: Molex; MP: 5027740891; ComponentLink1Description: Digikey; ComponentLink1URL: https://www.digikey.ca/en/products/detail/molex/5027740891/1952536; Digikey: WM24066CT-ND; ComponentLink2Description: Datasheet; ComponentLink2URL: https://www.molex.com/pdm_docs/sd/5027740891_sd.pdf
Q1-Q3 = CMP-1048-00605-1: Driver Transistor, NPN Silicon, 3-Pin SOT-23, Tape and Reel; Manufacturer: On Semiconductor; IC Continuous (A): 0.1; fT Min (MHz): 60; ComponentLink1Description: Manufacturer URL; ComponentLink3Description: Package Specification; ComponentLink2URL: http://www.onsemi.com/pub_link/Collateral/BSS64LT1-D.PDF; ComponentLink1URL: http://www.onsemi.com/; ComponentLink2Description: Datasheet; ComponentLink3URL: http://www.onsemi.cn/pub_link/Collateral/318-08.PDF; RoHS: FALSE; PackageVersion: Rev. AP, 11/2009; Polarity: NPN; PartNumber: BSS64LT1; Mounting Technology: Surface Mount; PackageDescription: 3-Pin Small Outline Transistor, Body 2.92 x 1.3 mm, Pitch 0.95 mm; Packing: Tape and Reel; DatasheetVersion: Rev. 5; PackageReference: SOT-23-3-318-08
R81 R83 R88 R89 R91 = RES 270.0 1/8W: RES SMD 270 OHM 5% 1/8W 0805; Power (Watts): 0.125W; Package: 0805; Value: 270; Tolerance: 5%
R82 = RES 4.7k 1/8W - 5%: RES SMD 4.7k OHM 5% 1/8W 0805; Power (Watts): 0.125W; Package: 0805; Value: 4.7k; Tolerance: 5%
R84 R92 = RES 47k 1/8W - 1%: RES SMD 47K OHM 1% 1/8W 0805; Power (Watts): 0.125W; Package: 0805; Value: 47k; Tolerance: 1%
R85 = RES 47.0 1/8W - 1%: RES SMD 47 OHM 1% 1/8W 0805; Power (Watts): 0.125W; Package: 0805; Value: 47; Tolerance: 1%
R86 R87 R93 = RES 100k 1/8W - 1%: RES SMD 100K OHM 1% 1/8W 0805; Power (Watts): 0.125W; Package: 0805; Value: 100k; Tolerance: 1%
R90 = RES 330.0 1/8W - 1%: RES SMD 330 OHM 1% 1/8W 0805; Rating: 0.125W; Package: 0805; Value: 330; Tolerance: 1%
S2 S3 = DS02-254-1L-04BE: Dip Switch Piano Key 4-position; Package: None; Price: None; Value: *; MP: DS02-254-1L-04BE; Availability: Unavailable

## Sheet Mainboard_Geneva_Interface.SchDoc
size A
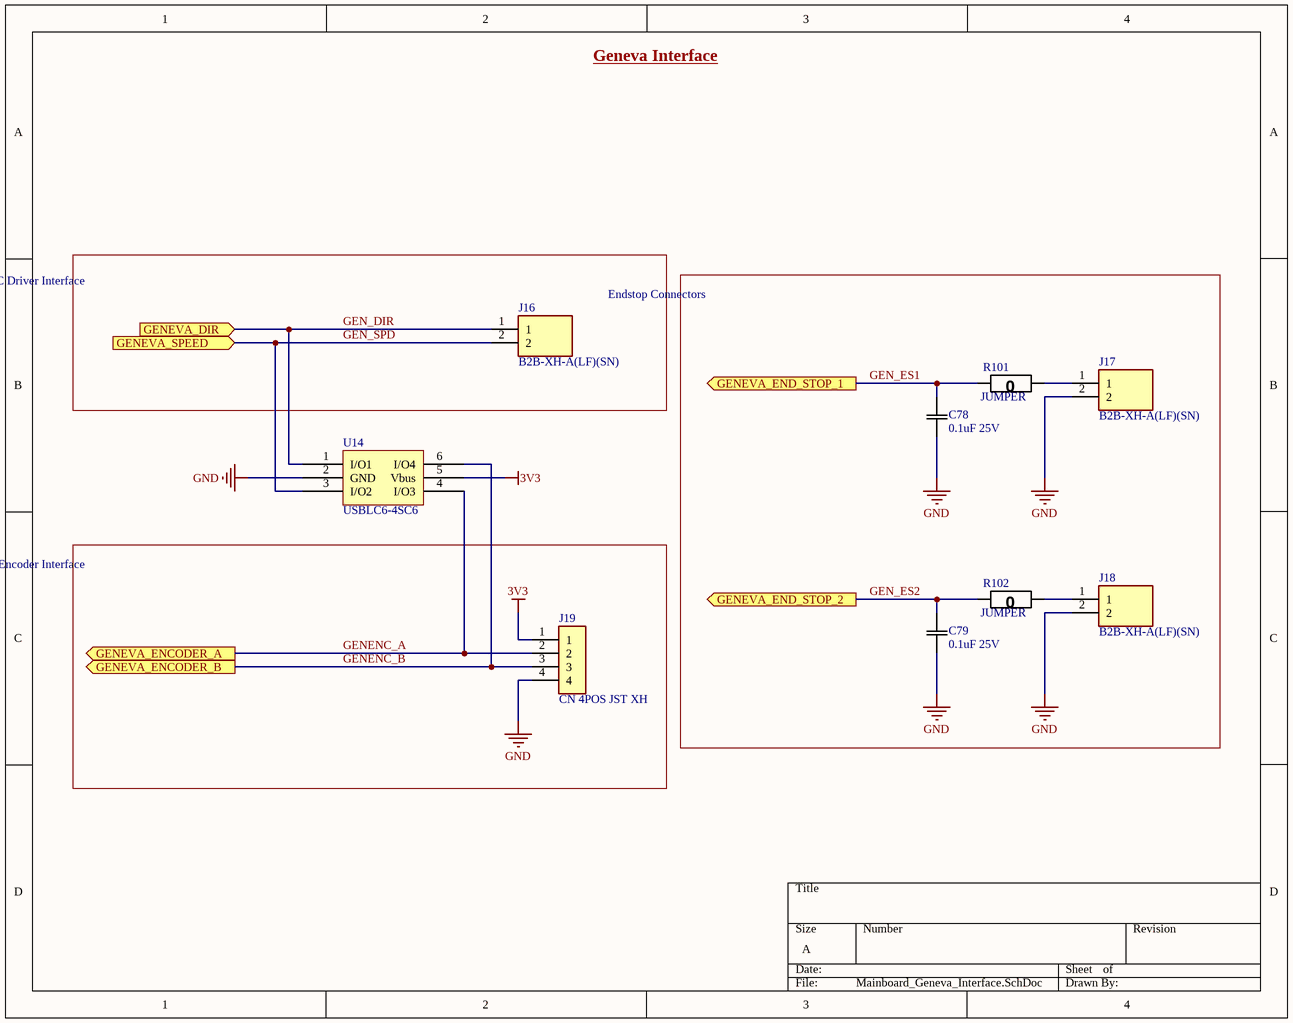
[diagram p13: Mainboard_Geneva_Interface.SchDoc]

### Parts
C78  0.1uF 25V  [0805]
C79  0.1uF 25V  [0805]
J16  B2B-XH-A(LF)(SN)  [JST_B2B-XH-A(LF)(SN)]
J17  B2B-XH-A(LF)(SN)  [JST_B2B-XH-A(LF)(SN)]
J18  B2B-XH-A(LF)(SN)  [JST_B2B-XH-A(LF)(SN)]
J19  CN 4POS JST XH  [JST_B4B-XH-A(LF)(SN)]
R101  JUMPER  [0805]
R102  JUMPER  [0805]
U14  USBLC6-4SC6  [SOT23-6L]

### Blocks framed on the sheet
DC Driver Interface: J16
Endstop Connectors: C78 C79 J17 J18 R101 R102
Encoder Interface: J19

### Ports
GENEVA_DIR (in), GENEVA_ENCODER_A (out), GENEVA_ENCODER_B (out), GENEVA_END_STOP_1 (out), GENEVA_END_STOP_2 (out), GENEVA_SPEED (in)

### Nets
3V3: J19.1 U14.5(Vbus)
GND: C78.2(C2) C79.2(C2) J17.2 J18.2 J19.4 U14.2(GND)
GEN_DIR: J16.1 U14.1(I/O1) ; port GENEVA_DIR
GEN_ES1: C78.1(C1) R101.2(R2) ; port GENEVA_END_STOP_1
GEN_ES2: C79.1(C1) R102.2(R2) ; port GENEVA_END_STOP_2
GEN_SPD: J16.2 U14.3(I/O2) ; port GENEVA_SPEED
GENENC_A: J19.2 U14.4(I/O3) ; port GENEVA_ENCODER_A
GENENC_B: J19.3 U14.6(I/O4) ; port GENEVA_ENCODER_B
NetJ17_1: J17.1 R101.1(R1)
NetJ18_1: J18.1 R102.1(R1)

### Notes on the sheet
- Geneva Interface

### Library data of the parts
C78 C79 = CAP 0.1uF 25V: CAP CER 0.1UF 25V X7R 0805; Tolerance: 10%; Value: 0.1uF; Temperature Coefficient: X7R; Rating: 25V; Operating Temperature: -55°C ~ 125°C
J16-J18 = B2B-XH-A(LF)(SN): as J15 on sheet Mainboard_ThermistorAmp; Price: None; Package: None; Value: *; Availability: Unavailable; SnapEDA_Link: https://www.snapeda.com/parts/B2B-XH-A%28LF%29%28SN%29/JST%20Sales%20America%20Inc./view-part/492310/?ref=snap
J19 = CN 4POS JST XH: Connector Header Through Hole 4 position 0.098 _2.50mm_ / B4B-XH-A(LF)(SN); MP: B4B-XH-A_LF__SN_; MF: JST Sales; Price: None; Package: None; Value: *; Availability: Unavailable; SnapEDA_Link: https://www.snapeda.com/parts/B4B-XH-A%28LF%29%28SN%29/JST%20Sales%20America%20Inc./view-part/447494/?ref=snap
R101 R102 = RES 0 JUMPER: as R76-R79 on sheet Mainboard_MCU_Func; Package: 0805

## Nets that join several sheets
3V3: Mainboard_Encoder_Interface (16 pins), Mainboard_RMII_Interface (10 pins), Mainboard_Wifi_Interface (J12.1), Mainboard_Breakbeam_Interface (J13.1), MainBoard_MCU_Power (20 pins), Mainboard_Debug_Interface (R80.1), Mainboard_MCU_Breakout (16 pins), Mainboard_MCU_Func (C76.2 C77.2 U10.5 U10.8), Mainboard_ThermistorAmp (C75.1 U13.8), Mainboard_User_Interface (5 pins), Mainboard_Geneva_Interface (J19.1 U14.5)
3V3_PWR_BRD: Mainboard_Power_Interface (J6.19 J6.20), MainBoard_MCU_Power (D2.A)
GND: Mainboard_Encoder_Interface (24 pins), Mainboard_Motordriver_Interface (70 pins), Mainboard_Power_Interface (8 pins), Mainboard_RMII_Interface (20 pins), Mainboard_Wifi_Interface (D4.2 J12.5 S4.N), Mainboard_Breakbeam_Interface (J13.3), MainBoard_MCU_Power (23 pins), Mainboard_Debug_Interface (6 pins), Mainboard_MCU_Breakout (12 pins), Mainboard_MCU_Func (12 pins), Mainboard_ThermistorAmp (C75.2 J15.2 U13.4), Mainboard_User_Interface (16 pins), Mainboard_Geneva_Interface (6 pins)
VCAP0: MainBoard_MCU_Power (C4.1), Mainboard_MCU_Breakout (U12.71)
VCAP1: MainBoard_MCU_Power (C5.1), Mainboard_MCU_Breakout (U12.106)
VCC: Mainboard_Motordriver_Interface (70 pins), Mainboard_Power_Interface (8 pins), Mainboard_User_Interface (R82.2)
COS_A: Mainboard_Encoder_Interface (R9.1 U5.1), Mainboard_MCU_Breakout (U12.28)
COS_B: Mainboard_Encoder_Interface (R35.1 U7.1), Mainboard_MCU_Breakout (U12.14)
COS_C: Mainboard_Encoder_Interface (R6.1 U4.1), Mainboard_MCU_Breakout (U12.18)
COS_D: Mainboard_Encoder_Interface (R30.1 U6.1), Mainboard_MCU_Breakout (U12.20)
GEN_DIR: Mainboard_MCU_Breakout (U12.129), Mainboard_Geneva_Interface (J16.1 U14.1)
GEN_ES1: Mainboard_MCU_Breakout (U12.128), Mainboard_Geneva_Interface (C78.1 R101.2)
GEN_ES2: Mainboard_MCU_Breakout (U12.127), Mainboard_Geneva_Interface (C79.1 R102.2)
GEN_SPD: Mainboard_MCU_Breakout (U12.96), Mainboard_Geneva_Interface (J16.2 U14.3)
GENENC_A: Mainboard_MCU_Breakout (U12.64), Mainboard_Geneva_Interface (J19.2 U14.4)
GENENC_B: Mainboard_MCU_Breakout (U12.97), Mainboard_Geneva_Interface (J19.3 U14.6)
NetC70_2: Mainboard_RMII_Interface (U9.15), Mainboard_Wifi_Interface (J12.4), Mainboard_Debug_Interface (U11.31), Mainboard_MCU_Breakout (U12.25), Mainboard_MCU_Func (C70.2 S1.4)
NetD4_1: Mainboard_Wifi_Interface (D4.1 R103.2), Mainboard_MCU_Breakout (U12.134)
NetF1_1: MainBoard_MCU_Power (F1.1), Mainboard_Debug_Interface (U11.22)
NetJ6_21: Mainboard_Power_Interface (J6.21), Mainboard_MCU_Breakout (U12.142)
NetJ6_22: Mainboard_Power_Interface (J6.22), Mainboard_MCU_Breakout (U12.140)
NetJ6_23: Mainboard_Power_Interface (J6.23), Mainboard_MCU_Breakout (U12.2)
NetJ6_24: Mainboard_Power_Interface (J6.24), Mainboard_MCU_Breakout (U12.139)
NetJ6_25: Mainboard_Power_Interface (J6.25), Mainboard_MCU_Breakout (U12.3)
NetJ6_26: Mainboard_Power_Interface (J6.26), Mainboard_MCU_Breakout (U12.135)
NetJ6_27: Mainboard_Power_Interface (J6.27), Mainboard_MCU_Breakout (U12.137)
NetJ6_29: Mainboard_Power_Interface (J6.29), Mainboard_MCU_Breakout (U12.136)
NetJ6_34: Mainboard_Power_Interface (J6.34), Mainboard_MCU_Breakout (U12.21), Mainboard_User_Interface (R84.2)
NetJ7_A12: Mainboard_Motordriver_Interface (J7.A12), Mainboard_MCU_Breakout (U12.50)
NetJ7_A14: Mainboard_Motordriver_Interface (J7.A14), Mainboard_MCU_Breakout (U12.110)
NetJ7_A15: Mainboard_Motordriver_Interface (J7.A15), Mainboard_MCU_Breakout (U12.104)
NetJ7_A16: Mainboard_Motordriver_Interface (J7.A16), Mainboard_MCU_Breakout (U12.100)
NetJ7_B16: Mainboard_Motordriver_Interface (J7.B16), Mainboard_MCU_Breakout (U12.91)
NetJ7_B17: Mainboard_Motordriver_Interface (J7.B17), Mainboard_MCU_Breakout (U12.92)
NetJ7_B18: Mainboard_Motordriver_Interface (J7.B18), Mainboard_MCU_Breakout (U12.90)
NetJ8_A12: Mainboard_Motordriver_Interface (J8.A12), Mainboard_MCU_Breakout (U12.46)
NetJ8_A14: Mainboard_Motordriver_Interface (J8.A14), Mainboard_MCU_Breakout (U12.76)
NetJ8_A15: Mainboard_Motordriver_Interface (J8.A15), Mainboard_MCU_Breakout (U12.102)
NetJ8_A16: Mainboard_Motordriver_Interface (J8.A16), Mainboard_MCU_Breakout (U12.75)
NetJ8_B16: Mainboard_Motordriver_Interface (J8.B16), Mainboard_MCU_Breakout (U12.85)
NetJ8_B17: Mainboard_Motordriver_Interface (J8.B17), Mainboard_MCU_Breakout (U12.86)
NetJ8_B18: Mainboard_Motordriver_Interface (J8.B18), Mainboard_MCU_Breakout (U12.80)
NetJ9_A12: Mainboard_Motordriver_Interface (J9.A12), Mainboard_MCU_Breakout (U12.26)
NetJ9_A14: Mainboard_Motordriver_Interface (J9.A14), Mainboard_MCU_Breakout (U12.69)
NetJ9_A15: Mainboard_Motordriver_Interface (J9.A15), Mainboard_MCU_Breakout (U12.101)
NetJ9_A16: Mainboard_Motordriver_Interface (J9.A16), Mainboard_MCU_Breakout (U12.47)
NetJ9_B16: Mainboard_Motordriver_Interface (J9.B16), Mainboard_MCU_Breakout (U12.4)
NetJ9_B17: Mainboard_Motordriver_Interface (J9.B17), Mainboard_MCU_Breakout (U12.22)
NetJ9_B18: Mainboard_Motordriver_Interface (J9.B18), Mainboard_MCU_Breakout (U12.12)
NetJ10_A12: Mainboard_Motordriver_Interface (J10.A12), Mainboard_MCU_Breakout (U12.49)
NetJ10_A14: Mainboard_Motordriver_Interface (J10.A14), Mainboard_MCU_Breakout (U12.81)
NetJ10_A15: Mainboard_Motordriver_Interface (J10.A15), Mainboard_MCU_Breakout (U12.103)
NetJ10_A16: Mainboard_Motordriver_Interface (J10.A16), Mainboard_MCU_Breakout (U12.82)
NetJ10_B16: Mainboard_Motordriver_Interface (J10.B16), Mainboard_MCU_Breakout (U12.88)
NetJ10_B17: Mainboard_Motordriver_Interface (J10.B17), Mainboard_MCU_Breakout (U12.89)
NetJ10_B18: Mainboard_Motordriver_Interface (J10.B18), Mainboard_MCU_Breakout (U12.87)
NetJ11_A12: Mainboard_Motordriver_Interface (J11.A12), Mainboard_MCU_Breakout (U12.37)
NetJ11_A14: Mainboard_Motordriver_Interface (J11.A14), Mainboard_MCU_Breakout (U12.67)
NetJ11_A15: Mainboard_Motordriver_Interface (J11.A15), Mainboard_MCU_Breakout (U12.65)
NetJ11_A16: Mainboard_Motordriver_Interface (J11.A16), Mainboard_MCU_Breakout (U12.66)
NetJ11_B16: Mainboard_Motordriver_Interface (J11.B16), Mainboard_MCU_Breakout (U12.68)
NetJ11_B17: Mainboard_Motordriver_Interface (J11.B17), Mainboard_MCU_Breakout (U12.79)
NetJ11_B18: Mainboard_Motordriver_Interface (J11.B18), Mainboard_MCU_Breakout (U12.48)
NetJ12_2: Mainboard_Wifi_Interface (J12.2), Mainboard_MCU_Breakout (U12.114)
NetJ12_3: Mainboard_Wifi_Interface (J12.3), Mainboard_MCU_Breakout (U12.34)
NetJ13_2: Mainboard_Breakbeam_Interface (J13.2), Mainboard_MCU_Breakout (U12.93)
NetJ14_1: Mainboard_MCU_Breakout (U12.111), Mainboard_User_Interface (J14.1)
NetJ14_2: Mainboard_MCU_Breakout (U12.112), Mainboard_User_Interface (J14.2)
NetJ14_3: Mainboard_MCU_Breakout (U12.116), Mainboard_User_Interface (J14.3)
NetJ14_5: Mainboard_MCU_Breakout (U12.113), Mainboard_User_Interface (J14.5)
NetJ14_7: Mainboard_MCU_Breakout (U12.98), Mainboard_User_Interface (J14.7)
NetJ14_8: Mainboard_MCU_Breakout (U12.99), Mainboard_User_Interface (J14.8)
NetPboot1_1: MainBoard_Top (Pboot1.1 Pboot1.2), Mainboard_MCU_Breakout (R94.1 U12.138)
NetR63_2: Mainboard_RMII_Interface (R63.2), Mainboard_MCU_Breakout (U12.44)
NetR64_2: Mainboard_RMII_Interface (R64.2), Mainboard_MCU_Breakout (U12.45)
NetR66_2: Mainboard_RMII_Interface (R66.2), Mainboard_MCU_Breakout (U12.43)
NetR85_2: Mainboard_MCU_Breakout (U12.60), Mainboard_User_Interface (R85.2)
NetR88_1: Mainboard_MCU_Breakout (U12.53), Mainboard_User_Interface (R88.1)
NetR89_1: Mainboard_MCU_Breakout (U12.54), Mainboard_User_Interface (R89.1)
NetR90_1: Mainboard_MCU_Breakout (U12.55), Mainboard_User_Interface (R90.1)
NetR92_2: Mainboard_MCU_Breakout (U12.63), Mainboard_User_Interface (R92.2)
NetR98_1: Mainboard_MCU_Breakout (U12.41), Mainboard_ThermistorAmp (R98.1)
NetR99_1: Mainboard_MCU_Breakout (U12.42), Mainboard_ThermistorAmp (R99.1)
NetR100_1: Mainboard_MCU_Breakout (U12.40), Mainboard_ThermistorAmp (R100.1)
NetS2_1A: Mainboard_MCU_Breakout (U12.56), Mainboard_User_Interface (S2.1A)
NetS2_2A: Mainboard_MCU_Breakout (U12.57), Mainboard_User_Interface (S2.2A)
NetS2_3A: Mainboard_MCU_Breakout (U12.58), Mainboard_User_Interface (S2.3A)
NetS2_4A: Mainboard_MCU_Breakout (U12.59), Mainboard_User_Interface (S2.4A)
NetS3_1A: Mainboard_MCU_Breakout (U12.117), Mainboard_User_Interface (S3.1A)
NetS3_2A: Mainboard_MCU_Breakout (U12.115), Mainboard_User_Interface (S3.2A)
NetS3_3A: Mainboard_MCU_Breakout (U12.118), Mainboard_User_Interface (S3.3A)
NetS3_4A: Mainboard_MCU_Breakout (U12.119), Mainboard_User_Interface (S3.4A)
NetU9_13: Mainboard_RMII_Interface (U9.13), Mainboard_MCU_Breakout (U12.27)
NetU10_4: Mainboard_MCU_Breakout (U12.5), Mainboard_MCU_Func (U10.4)
NetU10_9: Mainboard_MCU_Breakout (U12.7), Mainboard_MCU_Func (U10.9)
NetU10_13: Mainboard_MCU_Breakout (U12.11), Mainboard_MCU_Func (U10.13)
NetU10_14: Mainboard_MCU_Breakout (U12.10), Mainboard_MCU_Func (U10.14)
NetU11_4: Mainboard_Debug_Interface (U11.4), Mainboard_MCU_Breakout (U12.105)
NetU11_6: Mainboard_Debug_Interface (U11.6), Mainboard_MCU_Breakout (U12.133)
NetU11_12: Mainboard_Debug_Interface (U11.12), Mainboard_MCU_Breakout (U12.77)
NetU11_13: Mainboard_Debug_Interface (U11.13), Mainboard_MCU_Breakout (U12.109)
NetU11_15: Mainboard_Debug_Interface (U11.15), Mainboard_MCU_Breakout (U12.78)
PC14-OSC32_IN: Mainboard_MCU_Breakout (U12.8), Mainboard_MCU_Func (R77.2)
PC15-OSC32_OUT: Mainboard_MCU_Breakout (U12.9), Mainboard_MCU_Func (R79.2)
PH0-OSC_IN: Mainboard_MCU_Breakout (U12.23), Mainboard_MCU_Func (R76.2)
PH1-OSC_OUT: Mainboard_MCU_Breakout (U12.24), Mainboard_MCU_Func (R78.2)
RMII_MDIO: Mainboard_RMII_Interface (R55.1 U9.12), Mainboard_MCU_Breakout (U12.36)
RMII_REF_CLK: Mainboard_RMII_Interface (R72.2), Mainboard_MCU_Breakout (U12.35)
RMII_TX_EN: Mainboard_RMII_Interface (U9.16), Mainboard_MCU_Breakout (U12.70)
RMII_TXD0: Mainboard_RMII_Interface (U9.17), Mainboard_MCU_Breakout (U12.73)
RMII_TXD1: Mainboard_RMII_Interface (U9.18), Mainboard_MCU_Breakout (U12.74)
SIN_A: Mainboard_Encoder_Interface (R19.1 U5.7), Mainboard_MCU_Breakout (U12.29)
SIN_B: Mainboard_Encoder_Interface (R45.1 U7.7), Mainboard_MCU_Breakout (U12.13)
SIN_C: Mainboard_Encoder_Interface (R14.1 U4.7), Mainboard_MCU_Breakout (U12.15)
SIN_D: Mainboard_Encoder_Interface (R38.1 U6.7), Mainboard_MCU_Breakout (U12.19)